# EAGLE design PAC1720_Breakout (EAGLE 9.5.2)
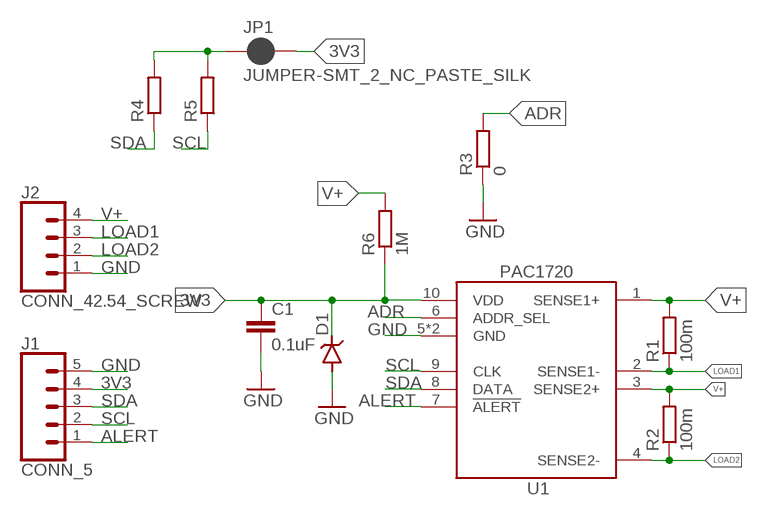
[diagram p0: schematic, sheet 1]

## Parts
C1  0.1uF  C-EU0.1UFC0402  [C0402]
D1  DIODE_ZENERSOD-123  [SOD-123]
J1  CONN_5  [1X05]
J2  CONN_42.54_SCREW  [1X04_SCREW]
JP1  JUMPER-SMT_2_NC_PASTE_SILK  [SMT-JUMPER_2_NC_PASTE_SILK]
R1  100m  R-EU_0.1R0805  [R0805]
R2  100m  R-EU_0.1R0805  [R0805]
R3  0  R-EU_0.0R0402  [R0402]
R4  R-EU_10KR0402  [R0402]
R5  R-EU_10KR0402  [R0402]
R6  1M  R-EU_1MR0402  [R0402]
U1  PAC1720  [VDFN-10]

## Nets
3V3: C1.1 D1.CAT(C) J1.4 JP1.2 R6.1 U1.10(VDD)
ADR: R3.2 U1.6(ADDR_SEL)
ALERT: J1.1 U1.7(!ALERT)
GND: C1.2 D1.ANODE(A) J1.5 J2.1 R3.1 U1.5(GND) U1.EP(GND)
LOAD1: J2.3 R1.1 U1.2(SENSE1-)
LOAD2: J2.2 R2.1 U1.4(SENSE2-)
N$1: JP1.1 R4.2 R5.2
SCL: J1.2 R5.1 U1.9(CLK)
SDA: J1.3 R4.1 U1.8(DATA)
V+: J2.4 R1.2 R2.2 R6.2 U1.1(SENSE1+) U1.3(SENSE2+)

## Library data of the parts
C1 = bschulz_passives:C-EU: CAPACITOR, European symbol; DIGIKEY: 490-4759-1-ND; MF: Murata; MPN: GCM155R71C104KA55D
D1 = bschulz:DIODE_ZENER: Generic Zener Diode; DIGIKEY: MMSZ5231B-FDICT-ND; MF: Diodes Incorporated; MPN: MMSZ5231B-7-F
J1 = bschulz:CONN_5: Genaric 5 terminal header; DIGIKEY: ED10564-ND; MF: On Shore; MPN: OSTVN05A150
J2 = bschulz:CONN_4: Genaric 4 terminal header Digikey 2.54_SCREW <https://www.digikey.com/product-detail/en/on-shore-technology-inc/OSTVN04A150/ED10563-ND/1588864>; DIGIKEY: ED10563-ND; MF: On Shore; MPN: OSTVN04A150
JP1 = SparkFun-Jumpers:JUMPER-SMT_2_NC_PASTE: Normally closed solder jumper This jumper has an aperture in the stencil to allow solder paste to bridge the split in the wire so it's normally closed (NC). Wick off the solder to open the connection. Reapply solder to reclose the connection.
R1 R2 = bschulz_passives:R-EU_: RESISTOR, European symbol Digikey Parts: Yageo, 0402 <https://www.digikey.com/products/en/resistors/chip-resistor-surface-mount/52?k=&pkeyword=&sv=0&s=4356&sf=1&FV=-1%7C13%2C7%7C2%2C1291%7C39157%2C1989%7C0%2C-8%7C52%2C3%7C1131%2C3%7C2503&quantity=&ColumnSort=0&page=1&stock=1&pageSize=25> Yageo, 0603 <https://www.digikey.com/products/en/resistors/chip-resistor-surface-mount/52?k=&pkeyword=&sv=0&pv1291=39245&sf=1&FV=-5%7C4356%2C-5%7C47360%2C-8%7C52%2C-1%7C13%2C7%7C2%2C1989%7C0&quantity=10&ColumnSort=1000011&page=1&stock=1&pageSize=25> Panasonic, 0603 <https://www.digikey.com/products/en/resistors/chip-resistor-surface-mount/52?k=&pkeyword=&pv252=68&sf=0&FV=ffec373d%2C1c0002%2C142c040c%2C1f140000%2Cffe00034%2C80002%2Cc0001&quantity=&ColumnSort=0&page=1&stock=1&pageSize=25> Panasonic, precision, 0603 <https://www.digikey.com/products/en/resistors/chip-resistor-surface-mount/52?FV=ffec4907%2Cfffc000a%2Cc0172%2C142c040c%2C1f140000%2Cffe00034%2C1c0002&quantity=100&ColumnSort=2085&page=1&stock=1&pageSize=25> Panasonic, 0805 <https://www.digikey.com/products/en/resistors/chip-resistor-surface-mount/52?k=&pkeyword=&pv3=1&sf=0&FV=ffec373d%2C1c0002%2C1f140000%2Cffe00034%2C142c040d&quantity=&ColumnSort=0&page=1&stock=1&pageSize=25> Rohm, current sense <https://www.digikey.com/products/en/resistors/chip-resistor-surface-mount/52?k=&pkeyword=&pv3=1&sf=0&FV=ffecb688%2C1f140000%2Cffe00034%2C1c0002&quantity=&ColumnSort=0&page=1&stock=1&pageSize=25> Vishay, pulse proof automotive <https://www.digikey.com/products/en/resistors/chip-resistor-surface-mount/52?k=&pkeyword=&pv7=2&sf=0&FV=ffec5d6b%2Cffe00034%2C1f140000&quantity=&ColumnSort=0&page=1&stock=1&pageSize=25>; DIGIKEY: P19308CT-ND; MF: Panasonic; MPN: ERJ-6DSFR10V
R3 = bschulz_passives:R-EU_: RESISTOR, European symbol Digikey Parts: Yageo, 0402 <https://www.digikey.com/products/en/resistors/chip-resistor-surface-mount/52?k=&pkeyword=&sv=0&s=4356&sf=1&FV=-1%7C13%2C7%7C2%2C1291%7C39157%2C1989%7C0%2C-8%7C52%2C3%7C1131%2C3%7C2503&quantity=&ColumnSort=0&page=1&stock=1&pageSize=25> Yageo, 0603 <https://www.digikey.com/products/en/resistors/chip-resistor-surface-mount/52?k=&pkeyword=&sv=0&pv1291=39245&sf=1&FV=-5%7C4356%2C-5%7C47360%2C-8%7C52%2C-1%7C13%2C7%7C2%2C1989%7C0&quantity=10&ColumnSort=1000011&page=1&stock=1&pageSize=25> Panasonic, 0603 <https://www.digikey.com/products/en/resistors/chip-resistor-surface-mount/52?k=&pkeyword=&pv252=68&sf=0&FV=ffec373d%2C1c0002%2C142c040c%2C1f140000%2Cffe00034%2C80002%2Cc0001&quantity=&ColumnSort=0&page=1&stock=1&pageSize=25> Panasonic, precision, 0603 <https://www.digikey.com/products/en/resistors/chip-resistor-surface-mount/52?FV=ffec4907%2Cfffc000a%2Cc0172%2C142c040c%2C1f140000%2Cffe00034%2C1c0002&quantity=100&ColumnSort=2085&page=1&stock=1&pageSize=25> Panasonic, 0805 <https://www.digikey.com/products/en/resistors/chip-resistor-surface-mount/52?k=&pkeyword=&pv3=1&sf=0&FV=ffec373d%2C1c0002%2C1f140000%2Cffe00034%2C142c040d&quantity=&ColumnSort=0&page=1&stock=1&pageSize=25> Rohm, current sense <https://www.digikey.com/products/en/resistors/chip-resistor-surface-mount/52?k=&pkeyword=&pv3=1&sf=0&FV=ffecb688%2C1f140000%2Cffe00034%2C1c0002&quantity=&ColumnSort=0&page=1&stock=1&pageSize=25> Vishay, pulse proof automotive <https://www.digikey.com/products/en/resistors/chip-resistor-surface-mount/52?k=&pkeyword=&pv7=2&sf=0&FV=ffec5d6b%2Cffe00034%2C1f140000&quantity=&ColumnSort=0&page=1&stock=1&pageSize=25>; DIGIKEY: 311-0.0JRCT-ND; MF: Yageo; MPN: RC0402JR-070RL; VALUE_PART: 0
R4 R5 = bschulz_passives:R-EU_: RESISTOR, European symbol Digikey Parts: Yageo, 0402 <https://www.digikey.com/products/en/resistors/chip-resistor-surface-mount/52?k=&pkeyword=&sv=0&s=4356&sf=1&FV=-1%7C13%2C7%7C2%2C1291%7C39157%2C1989%7C0%2C-8%7C52%2C3%7C1131%2C3%7C2503&quantity=&ColumnSort=0&page=1&stock=1&pageSize=25> Yageo, 0603 <https://www.digikey.com/products/en/resistors/chip-resistor-surface-mount/52?k=&pkeyword=&sv=0&pv1291=39245&sf=1&FV=-5%7C4356%2C-5%7C47360%2C-8%7C52%2C-1%7C13%2C7%7C2%2C1989%7C0&quantity=10&ColumnSort=1000011&page=1&stock=1&pageSize=25> Panasonic, 0603 <https://www.digikey.com/products/en/resistors/chip-resistor-surface-mount/52?k=&pkeyword=&pv252=68&sf=0&FV=ffec373d%2C1c0002%2C142c040c%2C1f140000%2Cffe00034%2C80002%2Cc0001&quantity=&ColumnSort=0&page=1&stock=1&pageSize=25> Panasonic, precision, 0603 <https://www.digikey.com/products/en/resistors/chip-resistor-surface-mount/52?FV=ffec4907%2Cfffc000a%2Cc0172%2C142c040c%2C1f140000%2Cffe00034%2C1c0002&quantity=100&ColumnSort=2085&page=1&stock=1&pageSize=25> Panasonic, 0805 <https://www.digikey.com/products/en/resistors/chip-resistor-surface-mount/52?k=&pkeyword=&pv3=1&sf=0&FV=ffec373d%2C1c0002%2C1f140000%2Cffe00034%2C142c040d&quantity=&ColumnSort=0&page=1&stock=1&pageSize=25> Rohm, current sense <https://www.digikey.com/products/en/resistors/chip-resistor-surface-mount/52?k=&pkeyword=&pv3=1&sf=0&FV=ffecb688%2C1f140000%2Cffe00034%2C1c0002&quantity=&ColumnSort=0&page=1&stock=1&pageSize=25> Vishay, pulse proof automotive <https://www.digikey.com/products/en/resistors/chip-resistor-surface-mount/52?k=&pkeyword=&pv7=2&sf=0&FV=ffec5d6b%2Cffe00034%2C1f140000&quantity=&ColumnSort=0&page=1&stock=1&pageSize=25>; DIGIKEY: 311-10.0KLRCT-ND; MF: Yageo; MPN: RC0402FR-0710KL; VALUE_PART: 10k
R6 = bschulz_passives:R-EU_: RESISTOR, European symbol Digikey Parts: Yageo, 0402 <https://www.digikey.com/products/en/resistors/chip-resistor-surface-mount/52?k=&pkeyword=&sv=0&s=4356&sf=1&FV=-1%7C13%2C7%7C2%2C1291%7C39157%2C1989%7C0%2C-8%7C52%2C3%7C1131%2C3%7C2503&quantity=&ColumnSort=0&page=1&stock=1&pageSize=25> Yageo, 0603 <https://www.digikey.com/products/en/resistors/chip-resistor-surface-mount/52?k=&pkeyword=&sv=0&pv1291=39245&sf=1&FV=-5%7C4356%2C-5%7C47360%2C-8%7C52%2C-1%7C13%2C7%7C2%2C1989%7C0&quantity=10&ColumnSort=1000011&page=1&stock=1&pageSize=25> Panasonic, 0603 <https://www.digikey.com/products/en/resistors/chip-resistor-surface-mount/52?k=&pkeyword=&pv252=68&sf=0&FV=ffec373d%2C1c0002%2C142c040c%2C1f140000%2Cffe00034%2C80002%2Cc0001&quantity=&ColumnSort=0&page=1&stock=1&pageSize=25> Panasonic, precision, 0603 <https://www.digikey.com/products/en/resistors/chip-resistor-surface-mount/52?FV=ffec4907%2Cfffc000a%2Cc0172%2C142c040c%2C1f140000%2Cffe00034%2C1c0002&quantity=100&ColumnSort=2085&page=1&stock=1&pageSize=25> Panasonic, 0805 <https://www.digikey.com/products/en/resistors/chip-resistor-surface-mount/52?k=&pkeyword=&pv3=1&sf=0&FV=ffec373d%2C1c0002%2C1f140000%2Cffe00034%2C142c040d&quantity=&ColumnSort=0&page=1&stock=1&pageSize=25> Rohm, current sense <https://www.digikey.com/products/en/resistors/chip-resistor-surface-mount/52?k=&pkeyword=&pv3=1&sf=0&FV=ffecb688%2C1f140000%2Cffe00034%2C1c0002&quantity=&ColumnSort=0&page=1&stock=1&pageSize=25> Vishay, pulse proof automotive <https://www.digikey.com/products/en/resistors/chip-resistor-surface-mount/52?k=&pkeyword=&pv7=2&sf=0&FV=ffec5d6b%2Cffe00034%2C1f140000&quantity=&ColumnSort=0&page=1&stock=1&pageSize=25>; DIGIKEY: 311-1.00MLRCT-ND; MF: Yageo; MPN: RC0402FR-071ML; VALUE_PART: 1M
U1 = bschulz:PAC1720: PAC1720 - High Side Current/Power Monitor with I2C Interface Characteristics: Vcc: 3V ~ 5.5V Iq: 5uA Common Mode Range: 0V ~ 40V Operating Temperature: -40°C to 85°C Digikey: PAC1720-1-AIA-CT-ND <https://www.digikey.com/product-detail/en/microchip-technology/PAC1720-1-AIA-TR/PAC1720-1-AIA-CT-ND/4490172>; DIGIKEY: PAC1720-1-AIA-CT-ND; MF: Microchip; MPN: PAC1720-1-AIA-TR

## Board
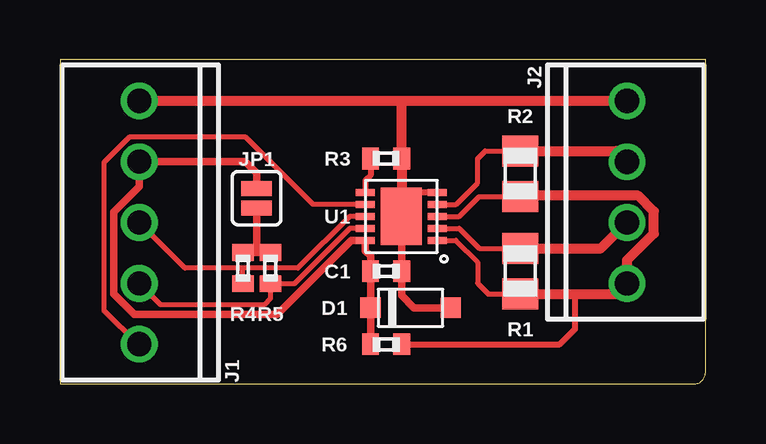
[diagram p1: board, top side]

Size 26.9 x 13.51 mm. Coordinates in mm from the lower left corner, seen from the top.
Outline: 0,0 26.4,0 arc90 26.9,0.5 26.9,13.51 0,13.51 0,0
Copper layers (1*16): Top 0.035559375mm / dielectric 1.6mm / Bottom 0.035559375mm
Design rules "oshpark-2layer": minimum track width 6mil, minimum drill 10mil, track to track 6mil, track to pad 6mil, pad to pad 6mil, via to via 6mil, smd to smd 6mil, copper to edge 15mil, drill to drill 6mil, minimum pad ring 5mil, minimum via ring 5mil, stop-mask expansion 2.5mil, vias tented up to drill 0mil, thermal gap 10mil

### Footprints (pad centres in the part's own frame; a part is rotated, then mirrored left to right if it is on the bottom)
C0402 = smd 0.7 x 0.9: 1 -0.65,0; 2 0.65,0
SOD-123 = smd 0.85 x 0.85: ANODE 1.675,0; CAT -1.675,0
1X05 = drill 1.016: 1 -5.08,0; 2 -2.54,0; 3 0,0; 4 2.54,0; 5 5.08,0
1X04_SCREW = drill 1.016: 1 -3.81,0; 2 -1.27,0; 3 1.27,0; 4 3.81,0
SMT-JUMPER_2_NC_PASTE_SILK = smd 0.635 x 1.27: 1 -0.406,0; 2 0.406,0
R0805 = smd 1.3 x 1.5: 1 -0.95,0; 2 0.95,0
R0402 = smd 0.7 x 0.9: 1 -0.65,0; 2 0.65,0
VDFN-10 = smd 0.8 x 0.3: 1 -1.5,1; 2 -1.5,0.5; 3 -1.5,0; 4 -1.5,-0.5; 5 -1.5,-1; 6 1.5,-1; 7 1.5,-0.5; 8 1.5,0; 9 1.5,0.5; 10 1.5,1 | smd 1.7 x 2.4: EP 0,0

### Placement (x,y rotation side)
C1  13.59,4.7 0 top
D1  14.61,3.17 0 top
J1  3.3,6.73 90 top
J2  23.62,8 270 top
JP1  8.19,7.75 90 top
R1  19.18,4.7 270 top
R2  19.18,8.76 270 top
R3  13.59,9.4 180 top
R4  7.62,4.83 90 top
R5  8.76,4.83 90 top
R6  13.59,1.65 0 top
U1  14.22,6.99 180 top

### Tracks (layer width: path | path; a pad name or v marks a point on that pad's centre or on a via)
3V3
  Top 0.305: R6.1 D1.CAT 12.94,3.18 C1.1 12.94,5.33 12.72,5.55 U1.10 12.14,5.99 9.06,2.9 3.09,2.9 2.23,3.75 2.23,7.17 3.3,8.24 J1.4 7.71,9.27 8.19,8.79 JP1.2
ADR
  Top 0.254: R3.2 12.94,8.71 12.72,8.49 U1.6
ALERT
  Top 0.2: U1.7 10.55,7.49 7.75,10.29 2.88,10.29 1.83,9.23 1.83,3.07 3.25,1.65 J1.1
GND
  Top 0.254: U1.5 14.34,7.99 14.22,7.87 U1.EP
  Top 0.305: D1.ANODE 14.75,3.17 14.24,3.68 C1.2 14.24,6.97 U1.EP
  Top 0.406: J1.5 14.22,11.81 | 14.22,11.81 J2.1 | 14.22,11.81 14.24,11.8 R3.1 14.24,6.97
LOAD1
  Top 0.2: U1.2 16.63,6.49 17.46,5.65 R1.1
  Top 0.406: R1.1 22.54,5.65 J2.3
LOAD2
  Top 0.2: U1.4 16.5,7.49 17.4,8.38 17.4,9.4 17.71,9.71 R2.1
  Top 0.406: R2.1 23.18,9.71 J2.2
N$1
  Top 0.305: R4.2 8.13,5.48 | 8.13,5.48 R5.2 | JP1.1 8.19,5.54 8.13,5.48
SCL
  Top 0.2: U1.9 12.07,6.49 9.76,4.18 R5.1 8.76,3.56 8.51,3.3 4.19,3.3 J1.2
SDA
  Top 0.2: U1.8 12.07,6.99 9.92,4.83 7.62,4.83 | J1.3 5.21,4.83 7.62,4.83 | R4.1 7.62,4.83
V+
  Top 0.2: U1.3 16.64,6.99 17.46,7.81 R2.2 | U1.1 16.49,5.99 17.4,5.08 17.4,4.19 17.84,3.75 R1.2
  Top 0.254: R6.2 20.83,1.65 21.46,2.29 21.46,3.75
  Top 0.406: R1.2 21.46,3.75 23.18,3.75 J2.4 23.62,5.15 24.74,6.27 24.74,7.19 24.09,7.85 19.21,7.85 R2.2

### Text on the board
tDocu: PAC1720 | B. Schulz / Break 44
bDocu: GND | GND | 3v3 | L2 | Load Connect | Data Out | SDA | L1 | SCL | Vin | ALRT